# Altium project Toolhead_board.PrjPcb
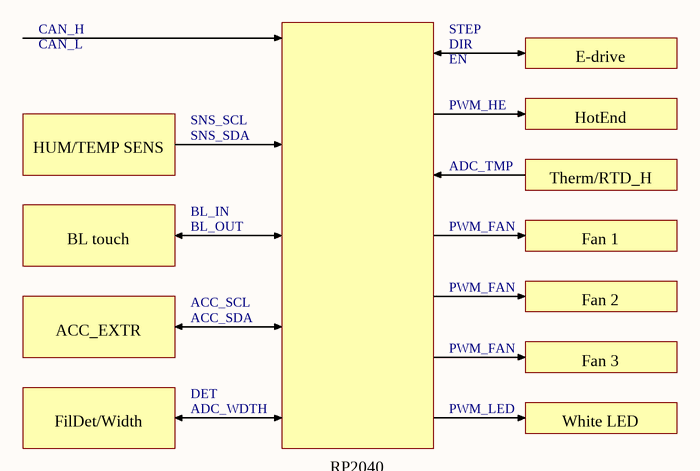
[diagram p0: Function Block Diagram.SchDoc]
11 sheets, 42 parts. Net scope: flat (ports and power ports of the same name join across sheets).
Sheets:
  Function Block Diagram.SchDoc
  MS35775 step motor driver.SchDoc
  CKS32F103C8T6 MCU.SchDoc
  HTU21D humitemp sensor.SchDoc
  MPU6500 accelerometer.SchDoc
  BL Touch ABL sensor.SchDoc
  Termistor input.SchDoc
  FAN.SchDoc
  LED.SchDoc
  Hotend driver.SchDoc
  SIT1051 CAN bus.SchDoc

## Sheet Function Block Diagram.SchDoc
size A4; SheetNumber: 1; SheetTotal: 12

### Notes on the sheet
- CAN_H
- CAN_L
- STEP
- DIR
- SNS_SCL
- EN
- PWM_HE
- E-drive
- HotEnd
- HUM/TEMP SENS
- SNS_SDA
- ADC_TMP
- Therm/RTD_H
- BL touch
- BL_IN
- BL_OUT
- PWM_FAN
- Fan 1
- ACC_EXTR
- ACC_SCL
- ACC_SDA
- Fan 2
- DET
- ADC_WDTH
- PWM_LED
- Fan 3
- White LED
- FilDet/Width
- RP2040

## Sheet MS35775 step motor driver.SchDoc
size A4; SheetNumber: 3; SheetTotal: 12
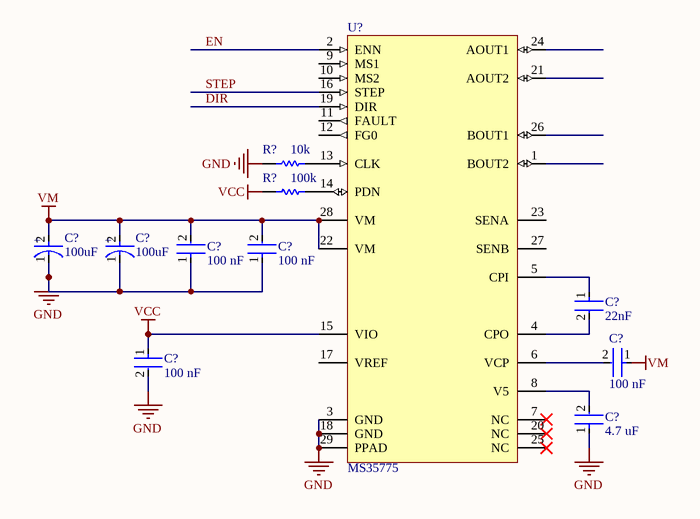
[diagram p1: MS35775 step motor driver.SchDoc]

### Parts
(Parts that share a designator on the sheet are numbered #1, #2 ... from top to bottom, then left to right.)
C?#1  Capacitance: 100uF  [FP-TQD8-MFG]  (hidden comment: EEE-TQV101XAP)
C?#2  Capacitance: 100uF  [FP-TQD8-MFG]  (hidden comment: EEE-TQV101XAP)
C?#3  Capacitance: 100 nF  [FP-CC0603-DA-MFG]  (hidden comment: CC0603KRX7R9BB104)
C?#4  Capacitance: 100 nF  [FP-CC0603-DA-MFG]  (hidden comment: CC0603KRX7R9BB104)
C?#5  Capacitance: 22nF  [FP-CC0603-DA-MFG]  (hidden comment: CC0603KRX7R9BB223)
C?#6  Capacitance: 100 nF  [FP-CC0603-DA-MFG]  (hidden comment: CC0603KRX7R9BB104)
C?#7  Capacitance: 100 nF  [FP-CC0603-DA-MFG]  (hidden comment: CC0603KRX7R9BB104)
C?#8  Capacitance: 4.7 uF  [FP-CC0603-DA-MFG]  (hidden comment: CC0603MRX5R5BB475)
R?#1  Resistance: 10k  [RESC1608X55X25LL10T15]  (hidden comment: RC0603FR-1310KL)
R?#2  Resistance: 100k  [RESC1608X55X25LL10T15]  (hidden comment: RC0603JR-10100KL)
U?#1  MS35775  [PQFN50P500X500X90_HS-29N]

### Nets
GND: C?#1.1(C) C?#2.1(C) C?#3.1 C?#4.1 C?#6.2 C?#8.1 R?#1.1 U?#1.3(GND) U?#1.18(GND) U?#1.29(PPAD)
VM: C?#1.2(A) C?#2.2(A) C?#3.2 C?#4.2 C?#7.1 U?#1.22(VM) U?#1.28(VM)
VСС: C?#6.1 R?#2.2 U?#1.15(VIO)
DIR: U?#1.19(DIR)
EN: U?#1.2(ENN)
STEP: U?#1.16(STEP)
NetC?#5_1: C?#5.1 U?#1.5(CPI)
NetC?#5_2: C?#5.2 U?#1.4(CPO)
NetC?#7_2: C?#7.2 U?#1.6(VCP)
NetC?#8_2: C?#8.2 U?#1.8(V5)
NetR?#1_2: R?#1.2 U?#1.13(CLK)
NetR?#2_1: R?#2.1 U?#1.14(PDN)

Not connected (* = marked no-connect by the designer): U?#1 1(BOUT2) 7(NC)* 9(MS1) 10(MS2) 11(FAULT) 12(FG0) 17(VREF) 20(NC)* 21(AOUT2) 23(SENA) 24(AOUT1) 25(NC)* 26(BOUT1) 27(SENB)

### Notes on the sheet
- (in symbol CMP-05427-000054-1) +

### Library data of the parts
C?#1 C?#2 = CMP-05427-000054-1: CAP ALUM 100UF 20% 35V SMD; Ripple Current: 197mA; ESR (Equivalent Series Resistance): 300mR; Life (Hours): 2000Hour; Lead Diameter: 0.65mm; Diameter: 6.3mm; Termination: SMD/SMT; Package Quantity: 900; Min Operating Temperature: -40°C; Mount: Surface Mount; Series: TQ; Height: 7.7mm; Length: 7.7mm; Max Operating Temperature: 125°C; Voltage Rating (DC): 35V; Voltage: 35V; Construction: Cylindrical; Ripple Current (AC): 197mA; Packaging: Tape and Reel; Lead Free: Lead Free; Height - Seated (Max): 0.315inch; Number of Pins: 8; Voltage Rating: 35V; Case/Package: Radial; Tolerance: 20%; REACH SVHC: No SVHC; Lead Pitch: 1.8mm; RoHS Compliant: Yes
C?#3 C?#4 C?#6 C?#7 = CMP-2100-03601-2: CAP CER 0.1UF 50V X7R 0603; Manufacturer: YAGEO; Material: Ceramic; Temperature Coefficient: 15%; Tolerance: 0.1; Value: 100 nF; Height: 0.9mm; Voltage: 50 V; ComponentLink2Description: Datasheet; Device Class L2: Capacitors; Temperature Range High: +125°C; Category: Cap; Footprint Url: http://www.yageo.com/exep/pages/download/literatures/UPY-C_GEN_24.pdf; ComponentLink2URL: http://www.yageo.com/documents/recent/UPY-GPHC_X7R_6.3V-to-50V_18.pdf; Package: CC0603-DA; Temperature: -55°C to +125°C; Voltage Rating: 50 V; Temperature Characteristic: X7R; Device Class L1: Passive Components; Temperature Range Low: -55°C; Manufacturer Part Number: CC0603KRX7R9BB104; RoHS: TRUE; Automotive: No; Device Class L3: Ceramic Capacitors; Octopart: https://octopart.com/cc0603krx7r9bb104-yageo-42244635; Mouser Description: Multilayer Ceramic Capacitor, CC Series, 0.1 - F, - 10%, X7R, 50 V, 0603 [1608 Metric]; Lead Free: Yes; Digikey Description: CAP CER 0.1UF 50V X7R 0603
C?#5 = CMP-2100-03602-3: CAP CER 0.022UF 50V X7R 0603; Dielectric Material: Ceramic; Insulation Resistance: 100GR; Tolerance: 10%; Thickness: 0.035inch; Case/Package: 0603; Packaging: Tape and Reel; Voltage Rating (DC): 50V; Length: 1.6mm; Depth: 0.8mm; Dielectric: X7R; Resistor Type: Ceramic; Min Operating Temperature: -55°C; Number of Pins: 2; Series: CC; Mount: Surface Mount; Max Operating Temperature: 125°C; Case Code (Imperial): 0603; Width: 0.031inch; Halogen Free: Halogen Free; Lead Free: Lead Free; Voltage: 50V; RoHS Compliant: Yes; Package Quantity: 1; Height: 0.8mm; REACH SVHC: No SVHC; Voltage Rating: 50V; Case Code (Metric): 1608; Termination: SMD/SMT; Radiation Hardening: No
C?#8 = CMP-1035-02782-2: CAP CER 4.7UF 6.3V X5R 0603; Manufacturer: YAGEO; Tolerance: 0.2; Temperature Coefficient: 15%; Material: Ceramic; Voltage Rating: 6.3 V; Package: CC0603-DA; Voltage: 6.3 V; Temperature Characteristic: X5R; Automotive: No; Temperature: -55°C to +125°C; Temperature Range Low: -55°C; Value: 4.7 uF; Temperature Range High: +125°C; Digikey Description: CAP CER 4.7UF 6.3V X5R 0603; Mouser Description: Multilayer Ceramic Capacitors MLCC - SMD/SMT 4.7uF 6.3V X5R 20%; Device Class L2: Capacitors; Lead Free: Yes; Footprint Url: http://www.yageo.com/exep/pages/download/literatures/UPY-C_GEN_24.pdf; ComponentLink2URL: http://www.yageo.com/documents/recent/UPY-GPHC_X7R_6.3V-to-50V_18.pdf; Height: 0.9mm; Device Class L3: Ceramic Capacitors; ComponentLink2Description: Datasheet; RoHS: TRUE; Device Class L1: Passive Components; Octopart: https://octopart.com/cc0603mrx5r5bb475-yageo-8376541; Manufacturer Part Number: CC0603MRX5R5BB475; Category: Cap
R?#1 = CMP-1659-00054-1: Chip Resistor, 10 KOhm, +/- 1%, 0.1 W, -55 to 155 degC, 0603 (1608 Metric), RoHS, Tape and Reel; Voltage Rating: 100 mV; Type (Resistor): Wirewound; Power Rating: 2 W; Min Operating Temperature: -55degC; ComponentLink2Description: Datasheet; Packaging: Bulk; Case/Package: Axial; ComponentLink2URL: http://www.yageo.com/documents/recent/PYu-RC_Group_51_RoHS_L_04.pdf; ComponentLink1URL: http://www.yageo.com/; RoHSCompliant: True; Length: 10.6 mm; Mount: Through Hole; Pins: 2; Diameter: 2.4 mm; PackageDescription: 2-Pin Surface Mount Device, Body 1.6 x 0.8 mm; Tolerance: 1%; REACH SVHC: Unknown; PackageReference: 0603; Package Quantity: 10; ComponentLink1Description: Manufacturer URL; DatasheetVersion: Rev. 4, 02/2016; Max Operating Temperature: 275degC
R?#2 = CMP-2000-04301-1: Manufacturer: Yageo; Part Number: RC0603JR-10100KL
U?#1 = MS35775: Low noise 256 subdivision microstepping motor driver.; Value: MS35775

## Sheet CKS32F103C8T6 MCU.SchDoc
size A4; SheetNumber: 4; SheetTotal: 12
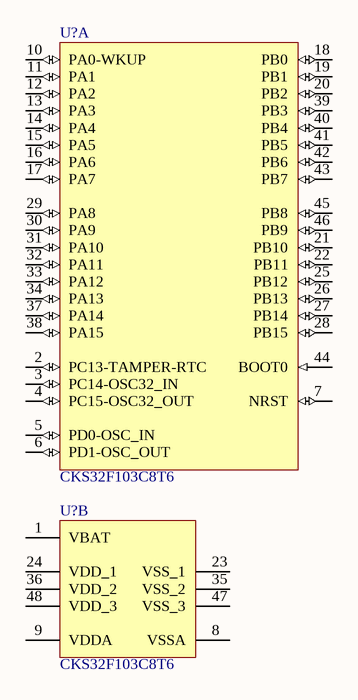
[diagram p2: CKS32F103C8T6 MCU.SchDoc]

### Parts
(Parts that share a designator on the sheet are numbered #1, #2 ... from top to bottom, then left to right.)
U?#2  CKS32F103C8T6  [TSQFP50P900X900X160-48N]  (part A of 2)
U?#3  CKS32F103C8T6  [TSQFP50P900X900X160-48N]  (part B of 2)

### Nets

Not connected (* = marked no-connect by the designer): U?#2 2(PC13-TAMPER-RTC) 3(PC14-OSC32_IN) 4(PC15-OSC32_OUT) 5(PD0-OSC_IN) 6(PD1-OSC_OUT) 7(NRST) 10(PA0-WKUP) 11(PA1) 12(PA2) 13(PA3) 14(PA4) 15(PA5) 16(PA6) 17(PA7) 18(PB0) 19(PB1) 20(PB2) 21(PB10) 22(PB11) 25(PB12) 26(PB13) 27(PB14) 28(PB15) 29(PA8) 30(PA9) 31(PA10) 32(PA11) 33(PA12) 34(PA13) 37(PA14) 38(PA15) 39(PB3) 40(PB4) 41(PB5) 42(PB6) 43(PB7) 44(BOOT0) 45(PB8) 46(PB9); U?#3 1(VBAT) 8(VSSA) 9(VDDA) 23(VSS_1) 24(VDD_1) 35(VSS_2) 36(VDD_2) 47(VSS_3) 48(VDD_3)

### Library data of the parts
U?#2 U?#3 = CKS32F103C8T6: ARM Cortex-M3 32-bit MCU, 64 KB Flash, 20 KB Internal RAM, 37 I/Os, 48-pin LQFP, -40 to 85 degC, Tray; Manufacturer: CKS; Part Number: CKS32F103C8T6; ComponentLink1URL: https://datasheet.lcsc.com/lcsc/2005271105_CKS-CKS32F103C8T6_C556576.pdf; ComponentLink1Description: Datasheet; Package: LQFP-48; Part Status: Active

## Sheet HTU21D humitemp sensor.SchDoc
size A4; SheetNumber: 5; SheetTotal: 12
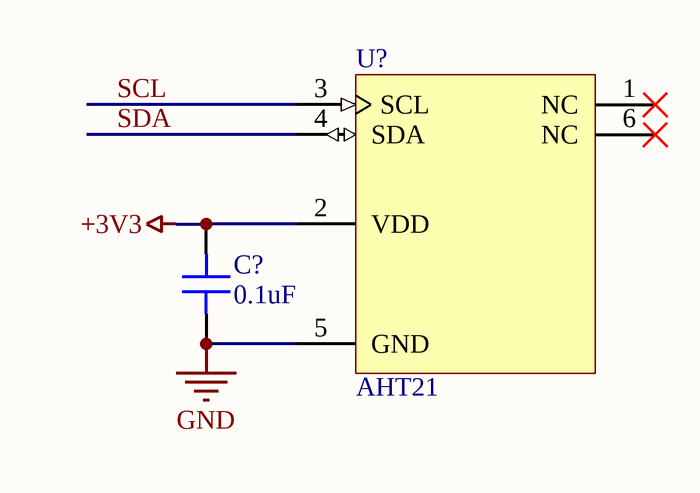
[diagram p3: HTU21D humitemp sensor.SchDoc]

### Parts
(Parts that share a designator on the sheet are numbered #1, #2 ... from top to bottom, then left to right.)
C?#9  0.1uF  [CAPC1005X06N]
U?#4  AHT21  [SMD_L3.0-W3.0-P1.00(AHT21)]

### Nets
+3V3: C?#9.2 U?#4.2(VDD)
GND: C?#9.1 U?#4.5(GND)
SCL: U?#4.3(SCL)
SDA: U?#4.4(SDA)

Not connected (* = marked no-connect by the designer): U?#4 1(NC)* 6(NC)*

### Library data of the parts
C?#9 = 0402B104K500CT: Manufacturer: Walsin Tech Corp; Voltage: 50V; Tolerance: 10%; Dielectric: X7R; Min Temperature: -55; Max Temperature: 125; ComponentLink1URL: https://datasheet.lcsc.com/lcsc/1810191621_Walsin-Tech-Corp-0402B104K500CT_C152814.pdf; ComponentLink1Description: Datasheet; Package: 0402; Part Status: Active; Capacitance: 0.1uF; Part Number: 0402B104K500CT
U?#4 = AHT21: MANUFACTURER: Aosong (Guangzhou) Elec; COMPONENTLINK1URL: https://datasheet.lcsc.com/lcsc/2104190935_Aosong--Guangzhou-Elec-AHT21_C2827328.pdf; COMPONENTLINK1DESCRIPTION: Datasheet; PACKAGE: SMD-3x3x1; Part Status: Active; Part Number: AHT21

## Sheet MPU6500 accelerometer.SchDoc
size A4; SheetNumber: 6; SheetTotal: 12
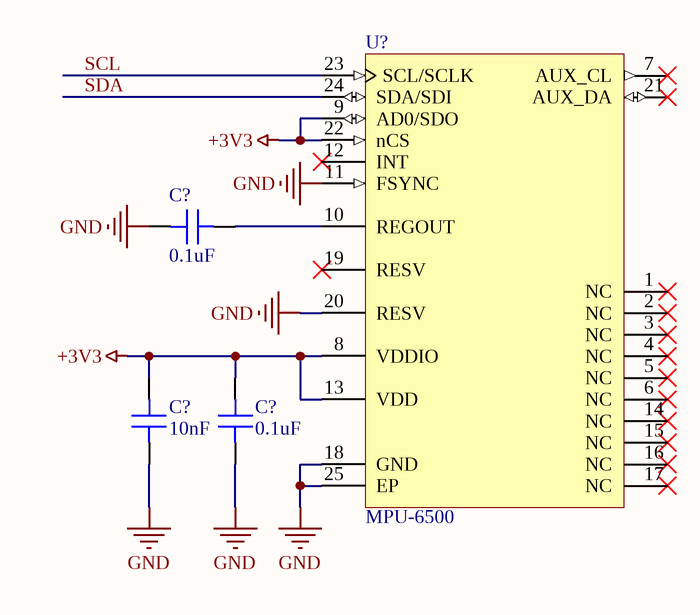
[diagram p4: MPU6500 accelerometer.SchDoc]

### Parts
(Parts that share a designator on the sheet are numbered #1, #2 ... from top to bottom, then left to right.)
C?#10  0.1uF  [CAPC1005X06N]
C?#11  10nF  [CAPC1005X06N]
C?#12  0.1uF  [CAPC1005X06N]
U?#5  MPU-6500  [QFN40P300X300X95_HS-25N]

### Nets
+3V3: C?#11.2 C?#12.2 U?#5.8(VDDIO) U?#5.9(AD0/SDO) U?#5.13(VDD) U?#5.22(nCS)
GND: C?#10.1 C?#11.1 C?#12.1 U?#5.11(FSYNC) U?#5.18(GND) U?#5.20(RESV) U?#5.25(EP)
SCL: U?#5.23(SCL/SCLK)
SDA: U?#5.24(SDA/SDI)
NetC?#10_2: C?#10.2 U?#5.10(REGOUT)

Not connected (* = marked no-connect by the designer): U?#5 1(NC)* 2(NC)* 3(NC)* 4(NC)* 5(NC)* 6(NC)* 7(AUX_CL)* 12(INT)* 14(NC)* 15(NC)* 16(NC)* 17(NC)* 19(RESV)* 21(AUX_DA)*

### Library data of the parts
C?#10 C?#12 = 0402B104K500CT: as C?#9 on sheet HTU21D humitemp sensor; PartNumber: 0402B104K500CT; ComponentLink1URL: https://datasheet.lcsc.com/lcsc/1810191621_Walsin-Tech-Corp-0402B104K500CT_C152814.pdf; ComponentLink1Description: Datasheet; Package: 0402; Part Status: Active; Capacitance: 0.1uF
C?#11 = 0402B103K500NT: Manufacturer: FH (Guangdong Fenghua Advanced Tech); Voltage: 50V; Tolerance: 10%; Dielectric: X7R; Min Temperature: -55; Max Temperature: 125; PartNumber: 0402B103K500NT; ComponentLink1URL: https://datasheet.lcsc.com/lcsc/1811141843_FH--Guangdong-Fenghua-Advanced-Tech-0402B103K500NT_C1524.pdf; ComponentLink1Description: Datasheet; Package: 0402; Part Status: Active; Capacitance: 10nF
U?#5 = MPU-6500: Manufacturer: TDK; PartNumber: MPU-6500; ComponentLink1URL: https://invensense.tdk.com/wp-content/uploads/2020/06/PS-MPU-6500A-01-v1.3.pdf; ComponentLink1Description: Datasheet; ComponentLink2URL: https://invensense.tdk.com/wp-content/uploads/2015/02/MPU-6500-Register-Map2.pdf; ComponentLink2Description: Register Maps; ComponentLink3URL: User Guides; ComponentLink3Description: https://invensense.tdk.com/wp-content/uploads/2017/06/AN-IVS-0001EVB-00-v1.4.pdf; Package: QFN-24EP; Part Status: Active

## Sheet BL Touch ABL sensor.SchDoc
size A4; SheetNumber: 7; SheetTotal: 7
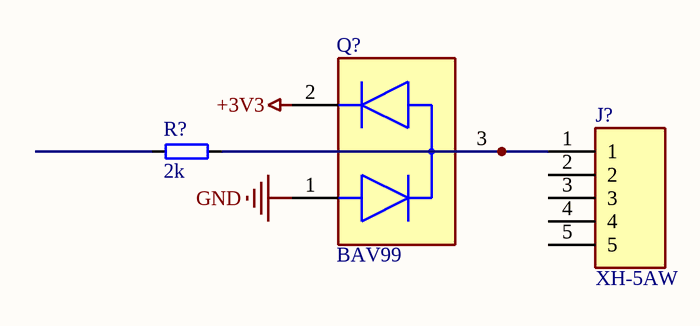
[diagram p5: BL Touch ABL sensor.SchDoc]

### Parts
(Parts that share a designator on the sheet are numbered #1, #2 ... from top to bottom, then left to right.)
J?  XH-5AW  [XH-5AW]
Q?  BAV99  [SOT95P280X120-3N]
R?#3  2k  [RESC1005X35N]

### Nets
+3V3: Q?.2
GND: Q?.1
NetJ?_1: J?.1 Q?.3 R?#3.2

Not connected (* = marked no-connect by the designer): J? 2 3 4 5; R?#3 1

### Library data of the parts
J? = XH-5AW: 1x5P XH 1 2.54mm Male pin 5 -25℃~+85℃ 3A Shrouded Push-Pull,P=2.54mm Wire To Board / Wire To Wire Connector ROHS; MANUFACTURER: HCTL; Part Number: XH-5AW; COMPONENTLINK1URL: https://datasheet.lcsc.com/lcsc/2110211930_HCTL-XH-5AW_C2908614.pdf; COMPONENTLINK1DESCRIPTION: Datasheet; PACKAGE: TH; Part Status: Active
Q? = BAV99: MANUFACTURER: FOSAN; Part Number: BAV99; COMPONENTLINK1URL: https://datasheet.lcsc.com/lcsc/2112031830_FOSAN-BAV99_C2926147.pdf; COMPONENTLINK1DESCRIPTION: Datasheet; PACKAGE: SOT23-3; Part Status: Active
R?#3 = WR04X2001FTL: Resistor; Manufacturer: Walsin Tech Corp; Tolerance: 1%; Power: 1/16 W; Temperature Coefficient: 100ppm; Min Temperature: -55°C; Max Temperature: 155°C; Part Number: WR04X2001FTL; ComponentLink1URL: https://datasheet.lcsc.com/lcsc/1810191630_Walsin-Tech-Corp-WR04X2001FTL_C163822.pdf; ComponentLink1Description: Datasheet; Package: 0402; Part Status: Active; Resistance: 2k

## Sheet Termistor input.SchDoc
size A4; SheetNumber: 8; SheetTotal: 11
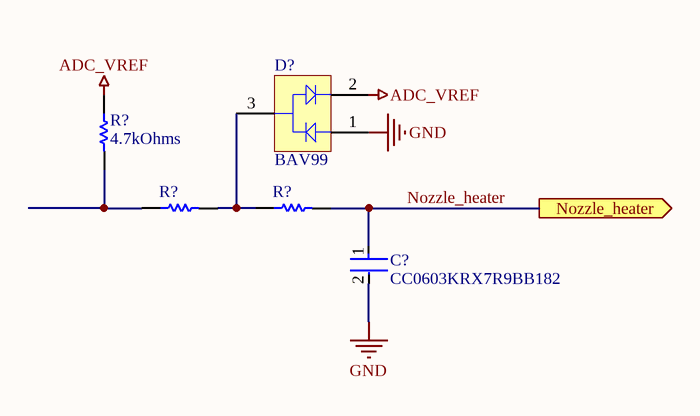
[diagram p6: Termistor input.SchDoc]

### Parts
(Parts that share a designator on the sheet are numbered #1, #2 ... from top to bottom, then left to right.)
C?#13  CC0603KRX7R9BB182  [FP-CC0603-DA-MFG]
D?#1  BAV99  [INF-SOT23_N]
R?#4  Resistance: 4.7kOhms  [RESC1608X55X25ML10T15]  (hidden comment: RC0603JR-074K7L)
R?#5  RC0603JR-07510RL  [RESC1608X55X25LL10T15]  (value not drawn)
R?#6  RK73H1JTTD2371F  [RESC1608X55X30NL20T10]  (value not drawn)

### Ports
Nozzle_heater (out)

### Nets
ADC_VREF: D?#1.2(K2) R?#4.1
GND: C?#13.2 D?#1.1(A1)
Nozzle_heater: C?#13.1 R?#6.2 ; port Nozzle_heater
NetD?#1_3: D?#1.3(C) R?#5.2 R?#6.1
NetR?#4_2: R?#4.2 R?#5.1

### Library data of the parts
C?#13 = CMP-03422-000899-1: CAP CER 1800PF 50V X7R 0603; Manufacturer: YAGEO; Description: CC0603 1.8 nF X7R 10.00% 50 V; Value: 1.8 nF; Temperature Coefficient: 15%; Material: Ceramic; Tolerance: 0.1; Category: Cap; Digikey Description: CAP CER 1800PF 50V X7R 0603; Temperature Range High: +125°C; Voltage: 50 V; Mouser Description: 0603 1.8 nF 50 V ±10 % Tolerance X7R SMT Multilayer Ceramic Capacitor; Temperature: -55°C to +125°C; Device Class L2: Capacitors; Automotive: No; Octopart: https://octopart.com/cc0603krx7r9bb182-yageo-42335658; Package: CC0603-DA; ComponentLink2URL: http://www.yageo.com/documents/recent/UPY-GPHC_X7R_6.3V-to-50V_18.pdf; Manufacturer Part Number: CC0603KRX7R9BB182; RoHS: TRUE; Footprint Url: http://www.yageo.com/exep/pages/download/literatures/UPY-C_GEN_24.pdf; Lead Free: Yes; Height: 0.9mm; Voltage Rating: 50 V; Temperature Characteristic: X7R; Temperature Range Low: -55°C; Capacitance: 1.8 nF; Device Class L1: Passive Components; ComponentLink2Description: Datasheet; Device Class L3: Ceramic Capacitors
D?#1 = CMP-1176-00014-1: Silicon Switching Diode, SOT23, Reel, Green; Manufacturer: Infineon; Green: TRUE; Mounting Technology: Surface Mount; ComponentLink3URL: http://www.infineon.com/dgdl/smbta14_mmbta14.pdf?folderId=db3a30431441fb5d011445c30f210183&fileId=db3a30431441fb5d011445ef0201018c; PartNumber: BAV99; ComponentLink2Description: Datasheet; ComponentLink2URL: http://www.infineon.com/dgdl/bav99series.pdf?folderId=db3a30431400ef6801141b5844e103ea&fileId=db3a30431400ef6801141c1b237d042f; PackageVersion: Apr-08; PackageDescription: 3-Pin Small Outline Transistor Package, 1.3 x 2.9 mm Body, 0.95 mm Pitch; RevisionNote: Re-Activated Devices; ComponentLink1URL: http://www.infineon.com/; PackageReference: SOT23; ComponentLink1Description: Manufacturer URL; ComponentLink3Description: Package Specification; Packing: Reel
R?#4 = CMP-2000-05024-1: Chip Resistor, 4.7 KOhm, +/- 5%, 100 mW, -55 to 155 degC, 0603 (1608 Metric), RoHS, Tape and Reel; Manufacturer: Yageo; Temperature Coefficient: 100PPM/C; Power Rating: 100mW; Voltage Rating: 50V; Operating Temperature Range: -55Cto+155C; Case Code - mm: 1608; Tolerance: 5%; Product: ThickFilmResistorsGeneralPurpose; Case Code - in: 0603; Datasheet URL: http://www.yageo.com/documents/recent/PYu-RC_Group_51_RoHS_L_04.pdf; Package Reference: 603; Datasheet Version: Rev. 4, 02/2016; Package Description: 2-Pin Surface Mount Device, Body 1.6 x 0.8 mm; Manufacturer URL: http://www.yageo.com/; Series: RC; Packaging: Reel; Termination Style: SMD/SMT
R?#5 = CMP-2000-04281-1: Manufacturer: Yageo; Part Number: RC0603JR-07510RL
R?#6 = CMP-2000-01325-1: Manufacturer: KOA Speer; Part Number: RK73H1JTTD2371F

## Sheet FAN.SchDoc
size A4; SheetNumber: 9; SheetTotal: 9

## Sheet LED.SchDoc
size A4; SheetNumber: 10; SheetTotal: 10

## Sheet Hotend driver.SchDoc
size A4; SheetNumber: 11; SheetTotal: 11

## Sheet SIT1051 CAN bus.SchDoc
size A4; SheetNumber: 12; SheetTotal: 12
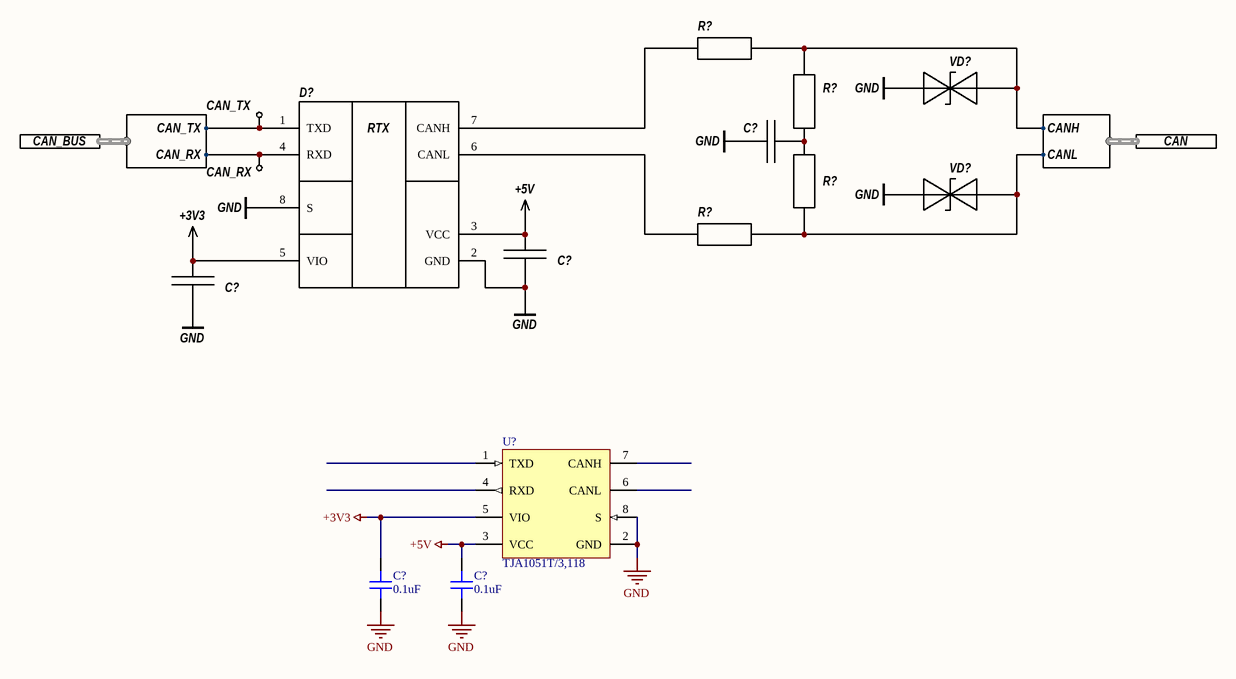
[diagram p7: SIT1051 CAN bus.SchDoc]

### Parts
(Parts that share a designator on the sheet are numbered #1, #2 ... from top to bottom, then left to right.)
C?#14  0.1uF  [C_0402]  (value not drawn)
C?#15  0.1uF  [C_0402]  (value not drawn)
C?#16  0.1uF  [C_0402]  (value not drawn)
C?#17  0.1uF  [CAPC1005X06N]
C?#18  0.1uF  [CAPC1005X06N]
D?#2  TCAN1051HVD  [SO_8_3p9_e1p27]  (value not drawn)
R?#7  10R  [R_0603]  (value not drawn)
R?#8  62R  [R_0603]  (value not drawn)
R?#9  62R  [R_0603]  (value not drawn)
R?#10  10R  [R_0603]  (value not drawn)
TP?#1  CAN_TX  [Via07_TEST]  (no BOM)
TP?#2  CAN_RX  [Via07_TEST]  (no BOM)
U?#6  TJA1051T/3,118  [NXP-SOIC-8_L]
VD?#1  SMAJ6,0CA-TR  [SMA]  (value not drawn)
VD?#2  SMAJ6,0CA-TR  [SMA]  (value not drawn)

### Ports
CAN (harness CANBUS), CAN_BUS (harness UART_CAN)

### Harnesses
CANBUS: CANL, CANH
UART_CAN: CAN_TX, CAN_RX

### Nets
+3V3: C?#16.2 C?#17.2 D?#2.5(VIO) U?#6.5(VIO)
+5V: C?#15.2 C?#18.2 D?#2.3(VCC) U?#6.3(VCC)
GND: C?#14.2 C?#15.1 C?#16.1 C?#17.1 C?#18.1 D?#2.2(GND) D?#2.8(S) U?#6.2(GND) U?#6.8(S) VD?#1.2 VD?#2.2
NetC?#14_1: C?#14.1 R?#8.1 R?#9.2
NetD?#2_1: D?#2.1(TXD) TP?#1.1 ; port CAN_BUS.CAN_TX
NetD?#2_4: D?#2.4(RXD) TP?#2.1 ; port CAN_BUS.CAN_RX
NetD?#2_6: D?#2.6(CANL) R?#10.1
NetD?#2_7: D?#2.7(CANH) R?#7.1
NetR?#7_2: R?#7.2 R?#8.2 VD?#1.1 ; port CAN.CANH
NetR?#9_1: R?#9.1 R?#10.2 VD?#2.1 ; port CAN.CANL

Not connected (* = marked no-connect by the designer): U?#6 1(TXD) 4(RXD) 6(CANL) 7(CANH)

### Notes on the sheet
- (in symbol Микросхема TCAN1051HVD) RTX

### Library data of the parts
C?#14-C?#16 = 0402-X7R-16V-0,1mkF ±10%: CAP CER 0.1UF 16V 10% X7R 0402; Manufacturer: Hitano Enterprise Co.; NameFromManufacturer: 0402B104K160NU; Place: S; Даташит: #\\svn-server\datasheets\Конденсаторы\TDK C Series.pdf#; Check: False; Склад ZIP: 9551937,87000000; Цена ZIP: 0,07029402; Статус ZIP: Действующее; Код SL: 301001004012925; Температура: 125°C; Part Number: 0402-X7R-16V-0,1mkF ±10%; Voltage: 16V; Tolerance: 10%; ComponentLink1URL: \\svn-server\datasheets\Конденсаторы\TDK C Series.pdf; ComponentLink1Description: DATASHEET; ComponentLink2Description: ТТ № 865; ComponentLink2URL: http://s01-3w01:19000/Kiep/documents/generalLists/_layouts/listform.aspx?PageType=4&ListId={72EB14B0-D142-4092-89FB-93824239B80E}&ID=872&ContentTypeID=0x01005F140719339A344182A674A570002819; Value: 0.1uF; ClassName: *
C?#17 C?#18 = 0402B104K500CT: as C?#9 on sheet HTU21D humitemp sensor; PartNumber: 0402B104K500CT; ComponentLink1URL: https://datasheet.lcsc.com/lcsc/1810191621_Walsin-Tech-Corp-0402B104K500CT_C152814.pdf; ComponentLink1Description: Datasheet; Package: 0402; Part Status: Active; Capacitance: 0.1uF
D?#2 = Микросхема TCAN1051HVD: CAN Transceiver with CAN FD; NameFromManufacturer: TCAN1051HVD, TCAN1051HVDR; Manufacturer: Texas Instruments; Код SL: 301002007022973; Даташит: #\\svn-server\datasheets\Микросхемы\TCAN1051HVDR.pdf#; Rem: Добавлено 07.02.2020; Check: False; Склад ZIP: 839,00000000; Цена ZIP: 748,48363200; Статус ZIP: Действующее; Value: TCAN1051HVD; Part Number: Микросхема TCAN1051HVD; ComponentLink1URL: \\svn-server\datasheets\Микросхемы\TCAN1051HVDR.pdf; ComponentLink1Description: DATASHEET; ClassName: *
R?#7 R?#10 = 0603-0,1W-10R-200ppm ±5%: *; NameFromManufacturer: RC0603J10R; Manufacturer: Faithful Link; Place: S; Check: True; Склад ZIP: 1286706,00000000; Цена ZIP: 0,03280386; Статус ZIP: Действующее; Код SL: 301004032005538; Даташит: \\svn-server\datasheets\Резисторы\R_0603.pdf#\\svn-server\datasheets\Резисторы\R_0603.pdf#; Tolerance: 5%; Power: 0,1W; PPM: 200ppm; Part Number: 0603-0,1W-10R-200ppm ±5%; ComponentLink1Description: DATASHEET; ComponentLink1URL: \\svn-server\datasheets\Резисторы\R_0603.pdf; Value: 10R; ComponentLink2URL: http://s01-3w01:19000/Kiep/documents/generalLists/_layouts/listform.aspx?PageType=4&ListId={72EB14B0-D142-4092-89FB-93824239B80E}&ID=550&ContentTypeID=0x01005F140719339A344182A674A570002819; ComponentLink2Description: ТТ № 543
R?#8 R?#9 = 0603-0,1W-62R-200ppm ±5%: *; NameFromManufacturer: 9C06031A62R0JLHFT; Manufacturer: Phycomp; Place: S; Tolerance: 5%; Power: 0,1W; PPM: 200ppm; Check: False; Склад ZIP: 210426,00000000; Цена ZIP: 0,05042050; Статус ZIP: Действующее; Код SL: 301004032005888; Даташит: \\svn-server\datasheets\Резисторы\R_0603.pdf#\\svn-server\datasheets\Резисторы\R_0603.pdf#; Part Number: 0603-0,1W-62R-200ppm ±5%; ComponentLink1Description: DATASHEET; ComponentLink1URL: \\svn-server\datasheets\Резисторы\R_0603.pdf; ComponentLink2Description: ТТ № 543; ComponentLink2URL: http://s01-3w01:19000/Kiep/documents/generalLists/_layouts/listform.aspx?PageType=4&ListId={72EB14B0-D142-4092-89FB-93824239B80E}&ID=550&ContentTypeID=0x01005F140719339A344182A674A570002819; Value: 62R
TP?#1 TP?#2 = Переходное отв. с тестовой точкой: *; Value: VIA_Test; Даташит: #\\svn-server\datasheets\Технология\Требования к печатным платам изм6 проект 2 (2).doc#; Check: False; Склад ZIP: 0; Part Number: Переходное отв. с тестовой точкой; ComponentLink1URL: \\svn-server\datasheets\Технология\Требования к печатным платам изм6 проект 2 (2).doc; ComponentLink1Description: DATASHEET; Manufacturer: *; NameFromManufacturer: *; Цена ZIP: 0; Статус ZIP: *
U?#6 = CMP-2000-07245-1: High-Speed CAN Transceiver, 3 to 5 V, 8-Pin SOIC (SOT96-1), RoHS, Tape and Reel; Manufacturer: NXP; Power Down Mode: Normal/Silent; Rad Hardened: No; Number of Transceivers: 1; Supply Current: 70mA; Operating Supply Voltage (Max): 5.5V; Operating Supply Voltage (Typ): 5V; Operating Supply Voltage (Min): 4.5V; Standard Supported: ISO11898-2; Data Rate: 1Mbps; DELETED: Compliant; Operating Temperature (Min): -40C; Datasheet Version: Rev. 7, 01/2015; Pin Count: 8; Operating Temperature (Max): 125C; Package Description: 8-Pin Small Outline Integrated Circuit, Body 4.9 x 3.9 mm, Pitch 1.27 mm; Category: Transceiver; Packaging: TapeandReel; Mounting: SurfaceMount; Package Reference: SOT96-1; Operating Temperature Classification: Automotive; Mounting Technology: SurfaceMount; Package Type: SO; Manufacturer URL: http://www.nxp.com/; Datasheet URL: http://www.nxp.com/documents/data_sheet/TJA1051.pdf
VD?#1 VD?#2 = Диод ограничительный SMAJ6,0CA-TR: TVS DIODE 6VWM 13.7VC SMA; Manufacturer: KLS Electronic Co., Ltd; Код SL: 301003010000369; Place: S; Даташит: \\Svn-server\datasheets\Диоды\SMAJ.pdf#\\Svn-server\datasheets\Диоды\SMAJ.pdf#; Check: True; Склад ZIP: 224751,00000000; Цена ZIP: 2,16248938; Статус ZIP: Действующее; Value: SMAJ6,0CA-TR; Part Number: Диод ограничительный SMAJ6,0CA-TR; ComponentLink1URL: \\Svn-server\datasheets\Диоды\SMAJ.pdf; ComponentLink1Description: DATASHEET; NameFromManufacturer: SMAJ6,0CA-TR; ClassName: *

## Nets that join several sheets
+3V3: HTU21D humitemp sensor (C?#9.2 U?#4.2), MPU6500 accelerometer (6 pins), BL Touch ABL sensor (Q?.2), SIT1051 CAN bus (C?#16.2 C?#17.2 D?#2.5 U?#6.5)
GND: MS35775 step motor driver (10 pins), HTU21D humitemp sensor (C?#9.1 U?#4.5), MPU6500 accelerometer (7 pins), BL Touch ABL sensor (Q?.1), Termistor input (C?#13.2 D?#1.1), SIT1051 CAN bus (11 pins)